# EAGLE design mouse_v4 (EAGLE 9.2.2)
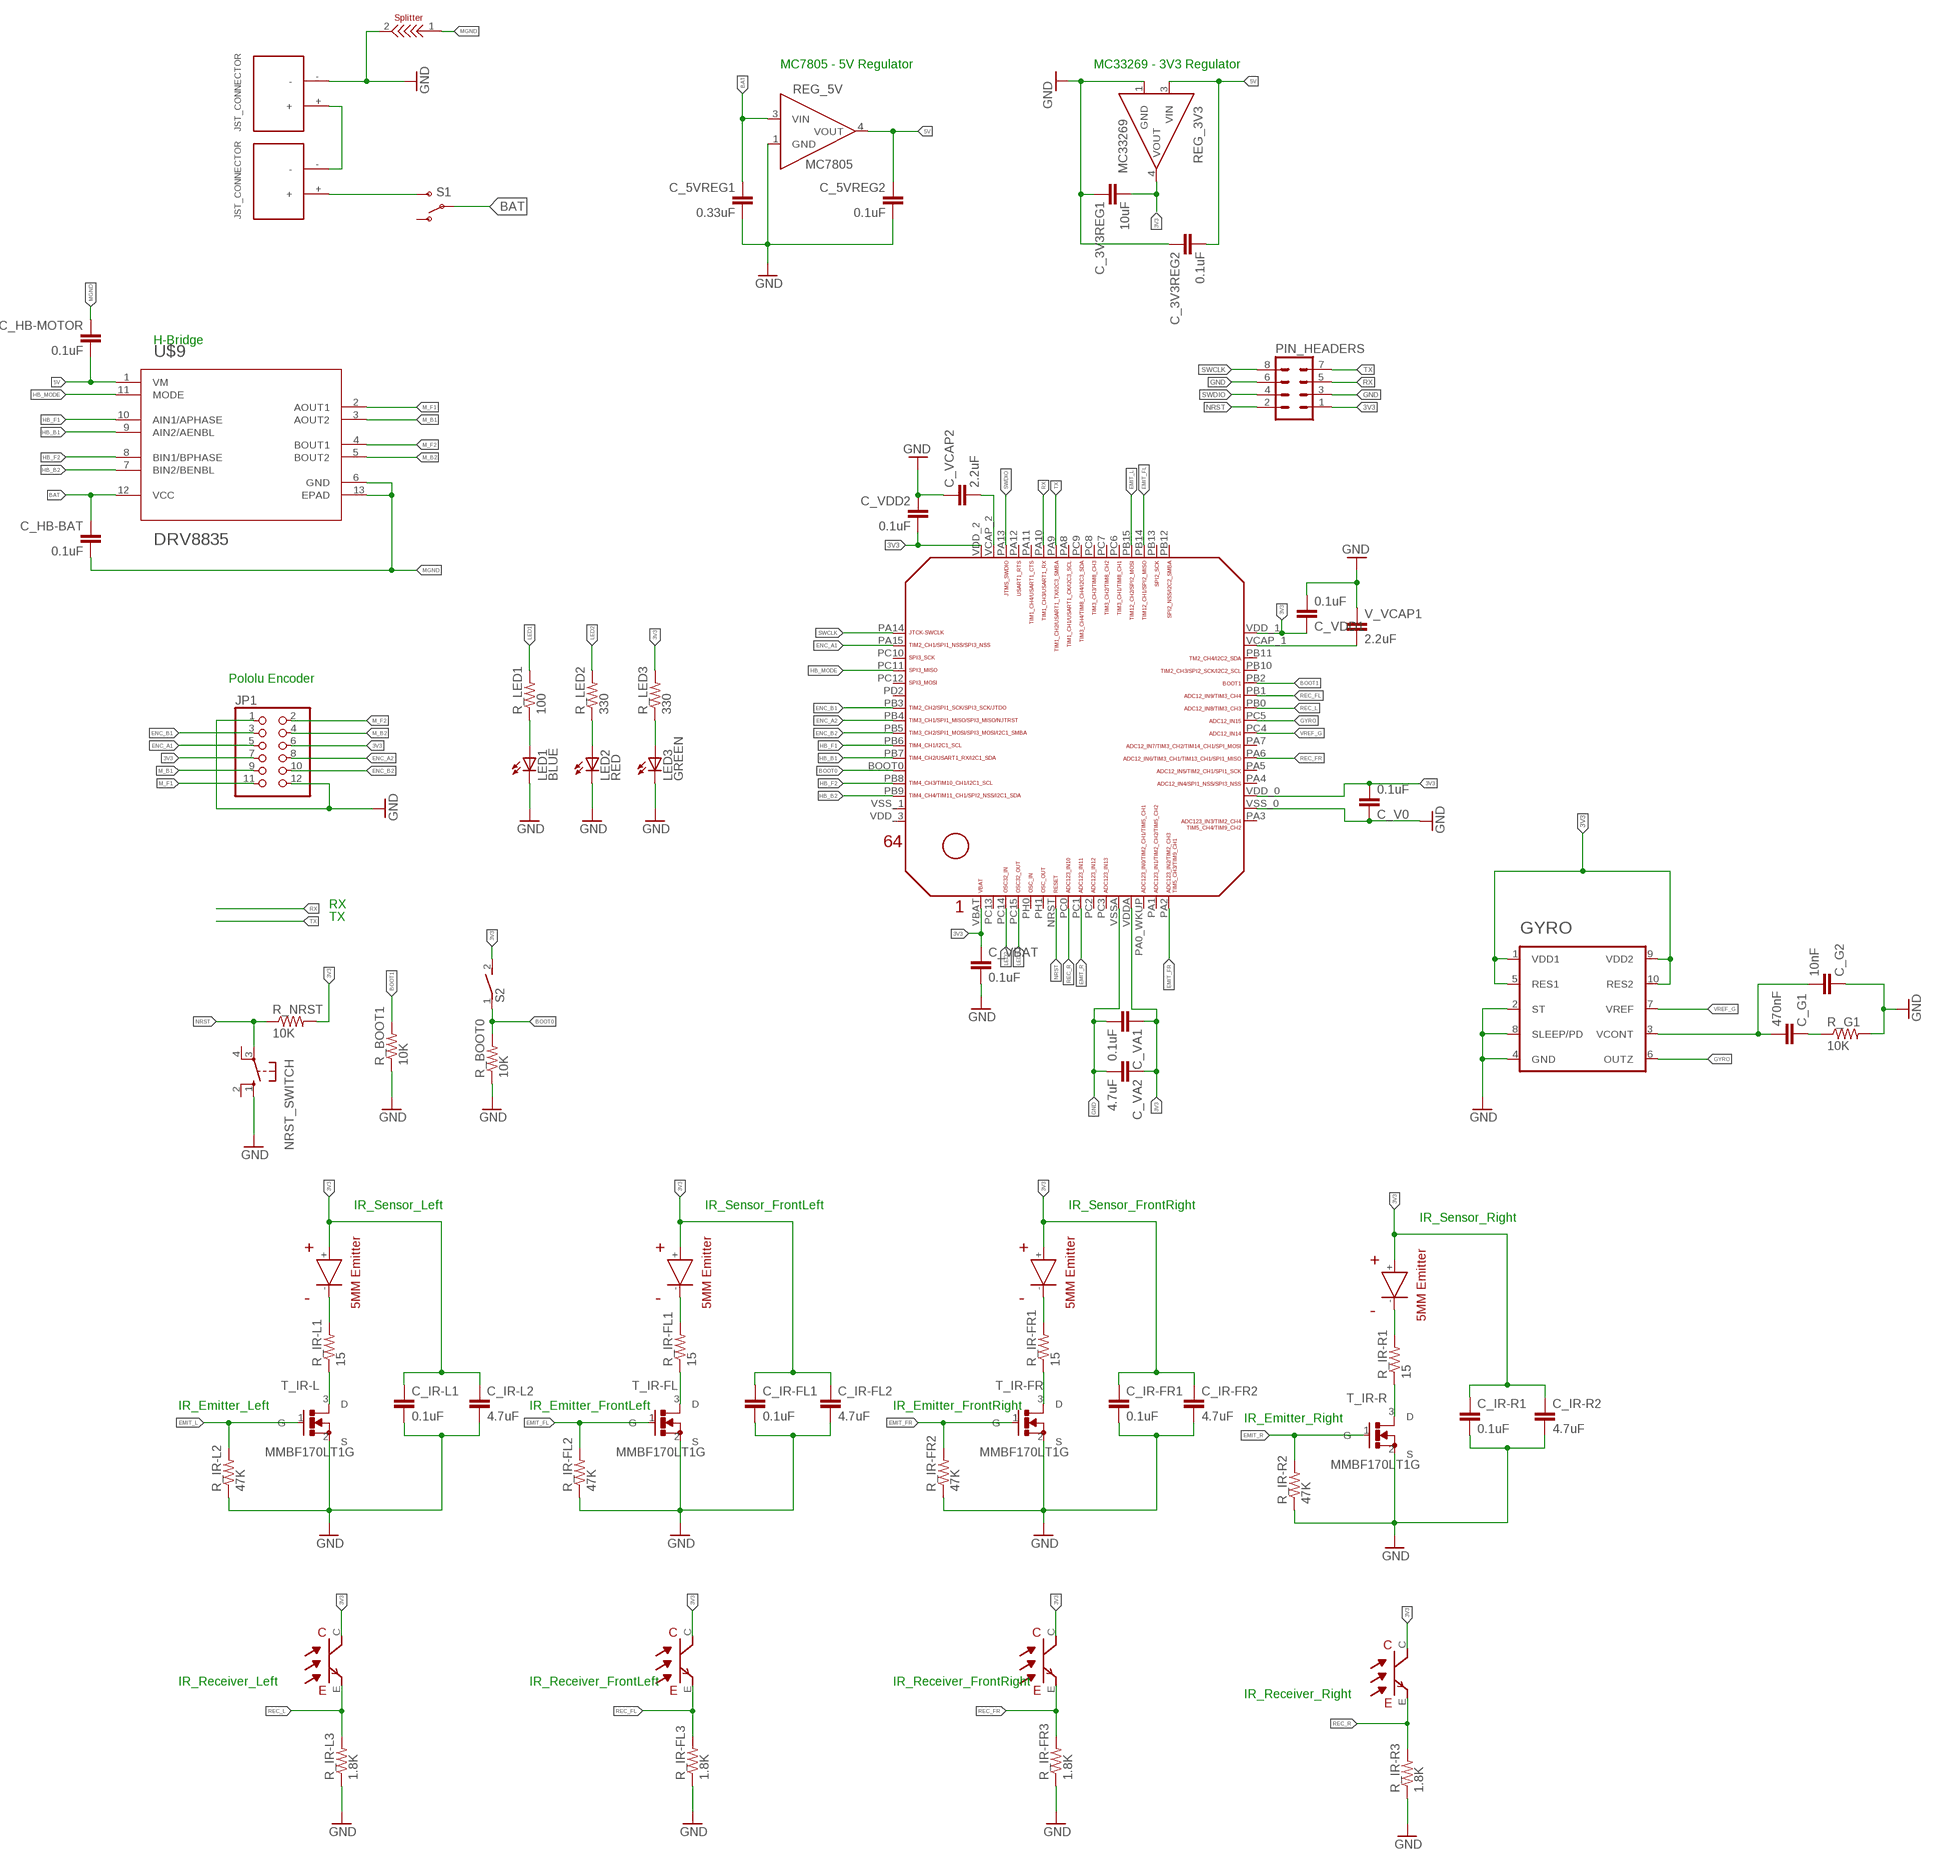
[diagram p0: schematic, sheet 1]

## Parts
C_3V3REG1  10uF  CAP0603-CAP  [0603-CAP]
C_3V3REG2  0.1uF  CAP0603-CAP  [0603-CAP]
C_5VREG1  0.33uF  CAP0603-CAP  [0603-CAP]
C_5VREG2  0.1uF  CAP0603-CAP  [0603-CAP]
C_G1  470nF  CAP0603-CAP  [0603-CAP]
C_G2  10nF  CAP0603-CAP  [0603-CAP]
C_HB-BAT  0.1uF  CAP0603-CAP  [0603-CAP]
C_HB-MOTOR  0.1uF  CAP0603-CAP  [0603-CAP]
C_IR-FL1  0.1uF  CAP0603-CAP  [0603-CAP]
C_IR-FL2  4.7uF  CAP0603-CAP  [0603-CAP]
C_IR-FR1  0.1uF  CAP0603-CAP  [0603-CAP]
C_IR-FR2  4.7uF  CAP0603-CAP  [0603-CAP]
C_IR-L1  0.1uF  CAP0603-CAP  [0603-CAP]
C_IR-L2  4.7uF  CAP0603-CAP  [0603-CAP]
C_IR-R1  0.1uF  CAP0603-CAP  [0603-CAP]
C_IR-R2  4.7uF  CAP0603-CAP  [0603-CAP]
C_V0  0.1uF  CAP0603-CAP  [0603-CAP]
C_VA1  0.1uF  CAP0603-CAP  [0603-CAP]
C_VA2  4.7uF  CAP0603-CAP  [0603-CAP]
C_VBAT  0.1uF  CAP0603-CAP  [0603-CAP]
C_VCAP2  2.2uF  CAP0603-CAP  [0603-CAP]
C_VDD1  0.1uF  CAP0603-CAP  [0603-CAP]
C_VDD2  0.1uF  CAP0603-CAP  [0603-CAP]
GYRO  LY3200ALH  [10-TLGA]
IR_FL  EMITTER  [EMITTER]
IR_FR  EMITTER  [EMITTER]
IR_L  EMITTER  [EMITTER]
IR_R  EMITTER  [EMITTER]
JP1  PINHD-2X6  [2X06]
LED1  BLUE  LEDCHIPLED_0603  [CHIPLED_0603]
LED2  RED  LEDCHIPLED_0603  [CHIPLED_0603]
LED3  GREEN  LEDCHIPLED_0603  [CHIPLED_0603]
NRST_SWITCH  10-XX  [B3F-10XX]
PIN_HEADERS  MA04-2  [MA04-2]
R_BOOT0  10K  1.8KOHM1/10W1%(0603)  [0603-RES]
R_BOOT1  10K  1.8KOHM1/10W1%(0603)  [0603-RES]
R_G1  10K  1.8KOHM1/10W1%(0603)  [0603-RES]
R_IR-FL1  15  1.8KOHM1/10W1%(0603)  [0603-RES]
R_IR-FL2  47K  1.8KOHM1/10W1%(0603)  [0603-RES]
R_IR-FL3  1.8K  1.8KOHM1/10W1%(0603)  [0603-RES]
R_IR-FR1  15  1.8KOHM1/10W1%(0603)  [0603-RES]
R_IR-FR2  47K  1.8KOHM1/10W1%(0603)  [0603-RES]
R_IR-FR3  1.8K  1.8KOHM1/10W1%(0603)  [0603-RES]
R_IR-L1  15  1.8KOHM1/10W1%(0603)  [0603-RES]
R_IR-L2  47K  1.8KOHM1/10W1%(0603)  [0603-RES]
R_IR-L3  1.8K  1.8KOHM1/10W1%(0603)  [0603-RES]
R_IR-R1  15  1.8KOHM1/10W1%(0603)  [0603-RES]
R_IR-R2  47K  1.8KOHM1/10W1%(0603)  [0603-RES]
R_IR-R3  1.8K  1.8KOHM1/10W1%(0603)  [0603-RES]
R_LED1  100  1.8KOHM1/10W1%(0603)  [0603-RES]
R_LED2  330  1.8KOHM1/10W1%(0603)  [0603-RES]
R_LED3  330  1.8KOHM1/10W1%(0603)  [0603-RES]
R_NRST  10K  1.8KOHM1/10W1%(0603)  [0603-RES]
REG_3V3  MC33269  [TO-252-3]
REG_5V  MC7805  [TO-252-3]
S1  SWITCH-SPSTKIT  [SWITCH-SPDT_KIT]
S2  DS01E  [DS-01]
T_IR-FL  MMBF170LT1G  [SOT-23]
T_IR-FR  MMBF170LT1G  [SOT-23]
T_IR-L  MMBF170LT1G  [SOT-23]
T_IR-R  MMBF170LT1G  [SOT-23]
U$1  STM32F405/415_LQFP64  [STM32F405/415_LQFP64]
U$2  JST_CONNECTOR_FEMALE  [JST_CONNECTOR_FEMALE]
U$3  JST_CONNECTOR_FEMALE  [JST_CONNECTOR_FEMALE]
U$4  RECEIVER  [RECEIVER]
U$5  RECEIVER  [RECEIVER]
U$6  RECEIVER  [RECEIVER]
U$7  RECEIVER  [RECEIVER]
U$8  SPLITTER  [SPLITTER]
U$9  DRV8835  [12-WFDFN]
V_VCAP1  2.2uF  CAP0603-CAP  [0603-CAP]

## Nets
3V3: C_3V3REG1.2 C_IR-FL1.1 C_IR-FL2.1 C_IR-FR1.1 C_IR-FR2.1 C_IR-L1.1 C_IR-L2.1 C_IR-R1.1 C_IR-R2.1 C_V0.2 C_VA1.1 C_VA2.1 C_VBAT.1 C_VDD1.1 C_VDD2.2 GYRO.1(VDD1) GYRO.5(RES1) GYRO.9(VDD2) GYRO.10(RES2) IR_FL.+ IR_FR.+ IR_L.+ IR_R.+ JP1.6 JP1.7 PIN_HEADERS.1 R_LED3.2 R_NRST.2 REG_3V3.4(VOUT) S2.2 U$1.VBAT U$1.VDD_0 U$1.VDD_1 U$1.VDD_2 U$1.VDDA U$4.C U$5.C U$6.C U$7.C
5V: C_3V3REG2.2 C_5VREG2.1 C_HB-MOTOR.2 REG_3V3.3(VIN) REG_5V.4(VOUT) U$9.1(VM)
BAT: C_5VREG1.1 C_HB-BAT.1 REG_5V.3(VIN) S1.2(P) U$9.12(VCC)
BOOT0: R_BOOT0.2 S2.1 U$1.BOOT0
BOOT1: R_BOOT1.2 U$1.PB2
EMIT_FL: R_IR-FL2.2 T_IR-FL.1(G) U$1.PB14
EMIT_FR: R_IR-FR2.2 T_IR-FR.1(G) U$1.PA2
EMIT_L: R_IR-L2.2 T_IR-L.1(G) U$1.PB15
EMIT_R: R_IR-R2.2 T_IR-R.1(G) U$1.PC1
ENC_A1: JP1.5 U$1.PA15
ENC_A2: JP1.8 U$1.PB4
ENC_B1: JP1.3 U$1.PB3
ENC_B2: JP1.10 U$1.PB5
GND: C_3V3REG1.1 C_3V3REG2.1 C_5VREG1.2 C_5VREG2.2 C_G2.1 C_IR-FL1.2 C_IR-FL2.2 C_IR-FR1.2 C_IR-FR2.2 C_IR-L1.2 C_IR-L2.2 C_IR-R1.2 C_IR-R2.2 C_V0.1 C_VA1.2 C_VA2.2 C_VBAT.2 C_VCAP2.1 C_VDD1.2 C_VDD2.1 GYRO.2(ST) GYRO.4(GND) GYRO.8(SLEEP/PD) JP1.1 JP1.12 LED1.C LED2.C LED3.C NRST_SWITCH.1(S) PIN_HEADERS.3 PIN_HEADERS.6 R_BOOT0.1 R_BOOT1.1 R_G1.2 R_IR-FL2.1 R_IR-FL3.1 R_IR-FR2.1 R_IR-FR3.1 R_IR-L2.1 R_IR-L3.1 R_IR-R2.1 R_IR-R3.1 REG_3V3.1(GND) REG_5V.1(GND) T_IR-FL.2(S) T_IR-FR.2(S) T_IR-L.2(S) T_IR-R.2(S) U$1.VSS_0 U$1.VSSA U$2.- U$8.2 V_VCAP1.1
GYRO: GYRO.6(OUTZ) U$1.PC5
HB_B1: U$1.PB7 U$9.9(AIN2/AENBL)
HB_B2: U$1.PB9 U$9.7(BIN2/BENBL)
HB_F1: U$1.PB6 U$9.10(AIN1/APHASE)
HB_F2: U$1.PB8 U$9.8(BIN1/BPHASE)
HB_MODE: U$1.PC11 U$9.11(MODE)
LED1: R_LED1.2 U$1.PC15
LED2: R_LED2.2 U$1.PC14
M_B1: JP1.9 U$9.3(AOUT2)
M_B2: JP1.4 U$9.5(BOUT2)
M_F1: JP1.11 U$9.2(AOUT1)
M_F2: JP1.2 U$9.4(BOUT1)
MGND: C_HB-BAT.2 C_HB-MOTOR.1 U$8.1 U$9.6(GND) U$9.13(EPAD)
N$2: C_VCAP2.2 U$1.VCAP_2
N$3: U$2.+ U$3.-
N$4: U$1.VCAP_1 V_VCAP1.2
N$5: C_G1.1 R_G1.1
N$6: S1.3(S) U$3.+
N$7: IR_FR.- R_IR-FR1.2
N$8: LED1.A R_LED1.1
N$9: C_G1.2 C_G2.2 GYRO.3(VCONT)
N$10: LED2.A R_LED2.1
N$11: LED3.A R_LED3.1
N$12: R_IR-FR1.1 T_IR-FR.3(D)
N$15: IR_R.- R_IR-R1.2
N$17: IR_FL.- R_IR-FL1.2
N$22: R_IR-FL1.1 T_IR-FL.3(D)
N$23: R_IR-R1.1 T_IR-R.3(D)
N$24: IR_L.- R_IR-L1.2
N$25: R_IR-L1.1 T_IR-L.3(D)
NRST: NRST_SWITCH.3(P) PIN_HEADERS.2 R_NRST.1 U$1.NRST
REC_FL: R_IR-FL3.2 U$1.PB1 U$5.E
REC_FR: R_IR-FR3.2 U$1.PA6 U$6.E
REC_L: R_IR-L3.2 U$1.PB0 U$4.E
REC_R: R_IR-R3.2 U$1.PC0 U$7.E
RX: PIN_HEADERS.5 U$1.PA10
SWCLK: PIN_HEADERS.8 U$1.PA14
SWDIO: PIN_HEADERS.4 U$1.PA13
TX: PIN_HEADERS.7 U$1.PA9
VREF_G: GYRO.7(VREF) U$1.PC4
Unconnected: NRST_SWITCH.2(S1) NRST_SWITCH.4(P1) S1.1(O) U$1.PA0_WKUP(PA0_AKUP) U$1.PA1 U$1.PA3 U$1.PA4 U$1.PA5 U$1.PA7 U$1.PA8 U$1.PA11 U$1.PA12 U$1.PB10 U$1.PB11 U$1.PB12 U$1.PB13 U$1.PC2 U$1.PC3 U$1.PC6 U$1.PC7 U$1.PC8 U$1.PC9 U$1.PC10 U$1.PC12 U$1.PC13 U$1.PD2 U$1.PH0 U$1.PH1 U$1.VDD_3 U$1.VSS_1

## Notes on the sheet
- MC7805 - 5V Regulator | MC33269 - 3V3 Regulator
- H-Bridge
- Pololu Encoder
- RX
- TX
- IR_Sensor_Left | IR_Sensor_FrontLeft | IR_Sensor_FrontRight
- IR_Sensor_Right
- IR_Emitter_Left | IR_Emitter_FrontLeft | IR_Emitter_FrontRight
- IR_Emitter_Right
- IR_Receiver_Left | IR_Receiver_FrontLeft | IR_Receiver_FrontRight
- IR_Receiver_Right

## Library data of the parts
C_3V3REG1 C_3V3REG2 C_5VREG1 C_5VREG2 C_G1 C_G2 C_HB-BAT C_HB-MOTOR C_IR-FL1 C_IR-FL2 C_IR-FR1 C_IR-FR2 C_IR-L1 C_IR-L2 C_IR-R1 C_IR-R2 C_V0 C_VA1 C_VA2 C_VBAT C_VCAP2 C_VDD1 C_VDD2 V_VCAP1 = SparkFun:CAP: Capacitor Standard 0603 ceramic capacitor, and 0.1" leaded capacitor.
GYRO = LY3200ALH:LY3200ALH
IR_FL IR_FR IR_L IR_R = sfh4550 _ teft4300:EMITTER
JP1 = pinhead:PINHD-2X6: PIN HEADER
LED1-LED3 = led:LED: LED OSRAM: - CHIPLED LG R971, LG N971, LY N971, LG Q971, LY Q971, LO R971, LY R971 LH N974, LH R974 LS Q976, LO Q976, LY Q976 LO Q996 - Hyper CHIPLED LW Q18S LB Q993, LB Q99A, LB R99A - SideLED LS A670, LO A670, LY A670, LG A670, LP A670 LB A673, LV A673, LT A673, LW A673 LH A674 LY A675 LS A676, LA A676, LO A676, LY A676, LW A676 LS A679, LY A679, LG A679 - Hyper Micro SIDELED® LS Y876, LA Y876, LO Y876, LY Y876 LT Y87S - SmartLED LW L88C, LW L88S LB L89C, LB L89S, LG L890 LS L89K, LO L89K, LY L89K LS L896, LA L896, LO L896, LY L896 - TOPLED LS T670, LO T670, LY T670, LG T670, LP T670 LSG T670, LSP T670, LSY T670, LOP T670, LYG T670 LG T671, LOG T671, LSG T671 LB T673, LV T673, LT T673, LW T673 LH T674 LS T676, LA T676, LO T676, LY T676, LB T676, LH T676, LSB T676, LW T676 LB T67C, LV T67C, LT T67C, LS T67K, LO T67K, LY T67K, LW E67C LS E67B, LA E67B, LO E67B, LY E67B, LB E67C, LV E67C, LT E67C LW T67C LS T679, LY T679, LG T679 LS T770, LO T770, LY T770, LG T770, LP T770 LB T773, LV T773, LT T773, LW T773 LH T774 LS E675, LA E675, LY E675, LS T675 LS T776, LA T776, LO T776, LY T776, LB T776 LHGB T686 LT T68C, LB T68C - Hyper Mini TOPLED® LB M676 - Mini TOPLED Santana® LG M470 LS M47K, LO M47K, LY M47K Source: http://www.osram.convergy.de LUXEON: - LUMILED® LXK2-PW12-R00, LXK2-PW12-S00, LXK2-PW14-U00, LXK2-PW14-V00 LXK2-PM12-R00, LXK2-PM12-S00, LXK2-PM14-U00 LXK2-PE12-Q00, LXK2-PE12-R00, LXK2-PE12-S00, LXK2-PE14-T00, LXK2-PE14-U00 LXK2-PB12-K00, LXK2-PB12-L00, LXK2-PB12-M00, LXK2-PB14-N00, LXK2-PB14-P00, LXK2-PB14-Q00 LXK2-PR12-L00, LXK2-PR12-M00, LXK2-PR14-Q00, LXK2-PR14-R00 LXK2-PD12-Q00, LXK2-PD12-R00, LXK2-PD12-S00 LXK2-PH12-R00, LXK2-PH12-S00 LXK2-PL12-P00, LXK2-PL12-Q00, LXK2-PL12-R00 Source: www.luxeon.com KINGBRIGHT: KA-3528ASYC Source: www.kingbright.com
NRST_SWITCH = switch-omron:10-XX: OMRON SWITCH; MPN: B3F-1000; OC_FARNELL: 176432; OC_NEWARK: 36M3542
PIN_HEADERS = con-lstb:MA04-2: PIN HEADER; OC_FARNELL: unknown; OC_NEWARK: unknown
R_BOOT0 R_BOOT1 R_G1 R_IR-FL1-R_IR-FL3 R_IR-FR1-R_IR-FR3 R_IR-L1-R_IR-L3 R_IR-R1-R_IR-R3 R_LED1-R_LED3 R_NRST = SparkFun-Resistors:1.8KOHM1/10W1%(0603): RES-09119; PROD_ID: RES-09119; VALUE: 1.8k
REG_3V3 = MC33269:MC33269
REG_5V = MC33269:MC7805
S1 = SparkFun:SWITCH-SPST: SPST Switch Simple slide switch. Spark Fun Electronics SKU : COM-00102
S2 = switch-dil:DS01E: DIL/CODE SWITCH; OC_FARNELL: unknown; OC_NEWARK: unknown
T_IR-FL T_IR-FR T_IR-L T_IR-R = MMBF170LT1:MMBF170LT1G; MANUFACTURER_PART_NUMBER: MMBF170LT1G; VENDOR: ON Semiconductor
U$1 = STM32F10x F4xx:STM32F405/415_LQFP64
U$2 U$3 = JST_CONNECTOR_FEMALE. through hole:JST_CONNECTOR_FEMALE
U$4-U$7 = sfh4550 _ teft4300:RECEIVER
U$8 = splitter:SPLITTER
U$9 = DRV8835:DRV8835

## Board
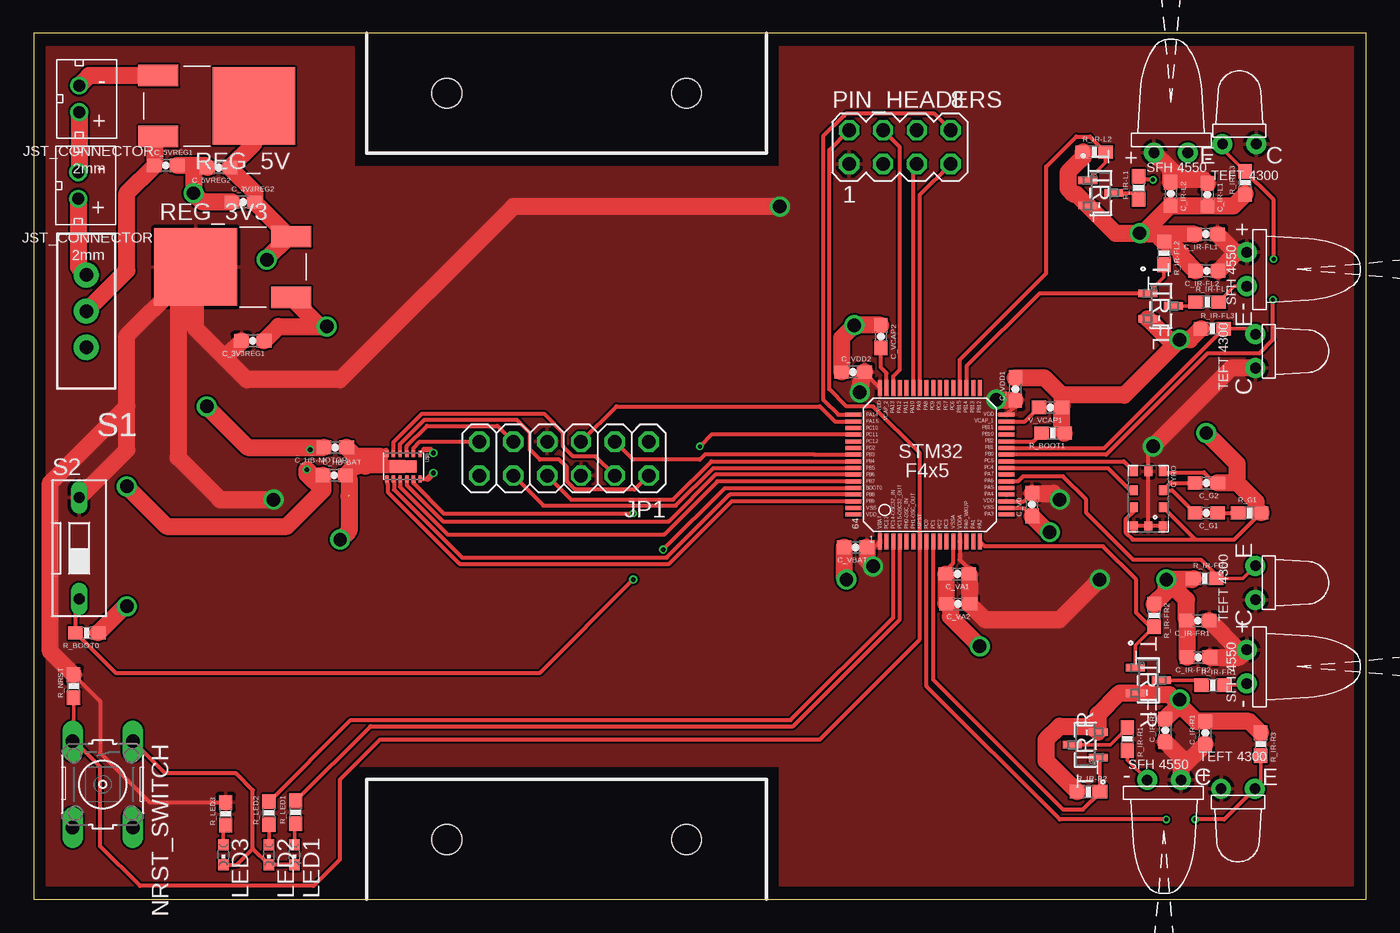
[diagram p1: board, top side]
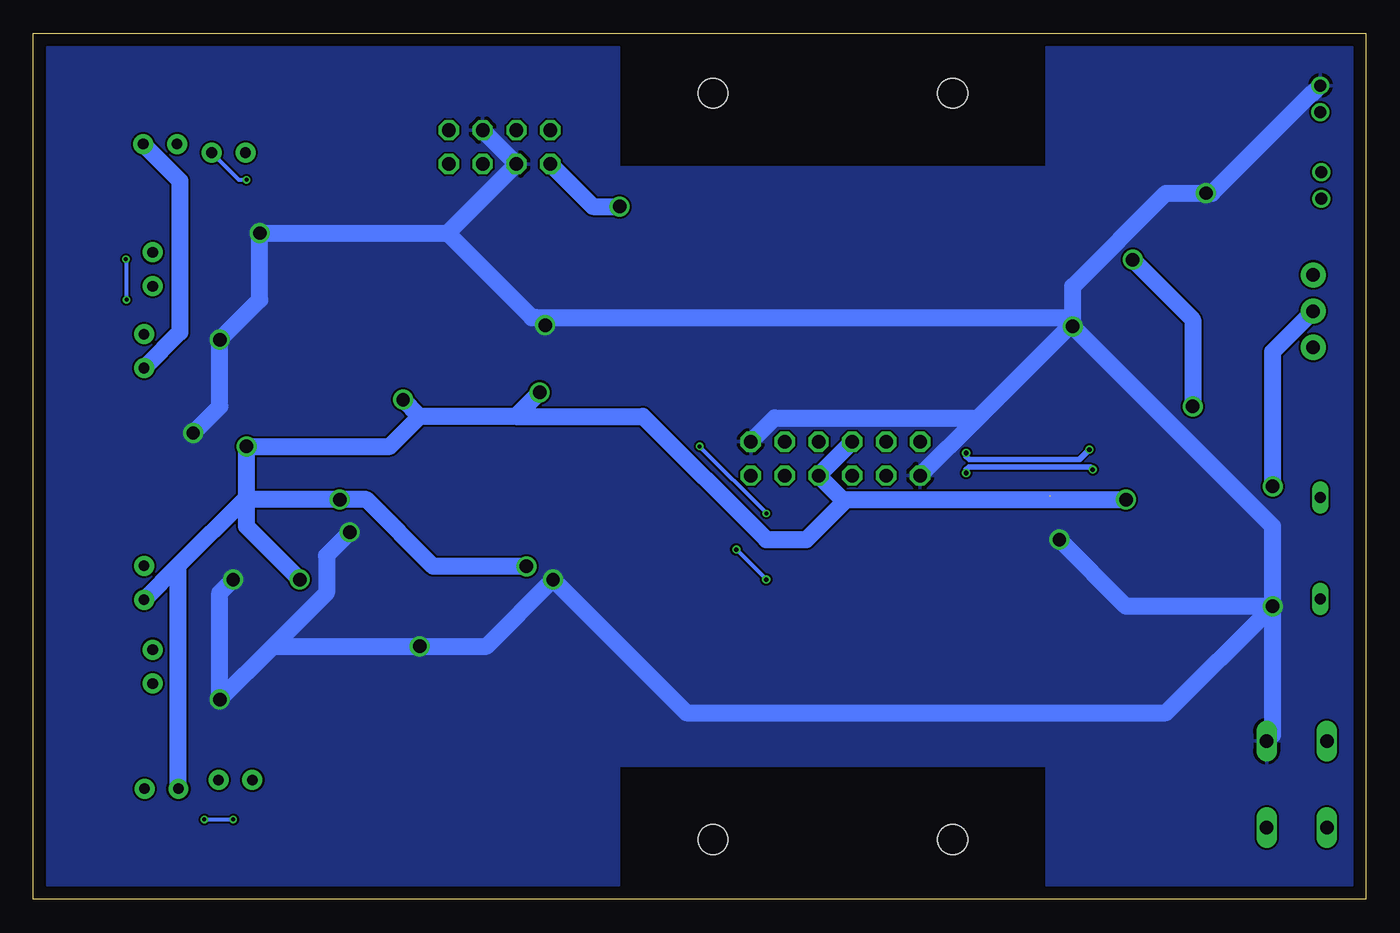
[diagram p2: board, bottom side, seen from below]

Size 100 x 65 mm. Coordinates in mm from the lower left corner, seen from the top.
Outline: 0,0 100,0 100,65 0,65 0,0
Copper layers (1*16): Top 0.035559375mm / dielectric 1.6mm / Bottom 0.035559375mm
Design rules "oshpark-2layer": minimum track width 6mil, minimum drill 10mil, track to track 6mil, track to pad 6mil, pad to pad 6mil, via to via 6mil, smd to smd 6mil, copper to edge 15mil, drill to drill 6mil, minimum pad ring 5mil, minimum via ring 5mil, stop-mask expansion 2.5mil, vias tented up to drill 0mil, thermal gap 10mil
Holes 2.25 mm at 31,4.5 49,4.5 49,60.5 31,60.5
tKeepout: area 25,56 to 55,65; area 25,0 to 55,9
bKeepout: area 25,0 to 55,9; area 25,56 to 55,65
tRestrict: area 25,0 to 55,9; area 25,56 to 55,65
bRestrict: area 25,0 to 55,9; area 25,56 to 55,65

### Footprints (pad centres in the part's own frame; a part is rotated, then mirrored left to right if it is on the bottom)
0603-CAP = smd 1.1 x 1: 1 -0.85,0; 2 0.85,0
10-TLGA = smd 0.7 x 0.6: 1 2.05,1.1; 2 0.635,1.1; 3 -0.635,1.1; 4 -2.05,1.1; 5 -2.05,0; 6 -2.05,-1.1; 7 -0.635,-1.1; 8 0.635,-1.1; 9 2.05,-1.1; 10 2.05,0
EMITTER = drill 0.8 pad 1.5: + -1.27,-0.5; - 1.27,-0.5
2X06 = drill 1.016 octagon: 1 -6.35,-1.27; 2 -6.35,1.27; 3 -3.81,-1.27; 4 -3.81,1.27; 5 -1.27,-1.27; 6 -1.27,1.27; 7 1.27,-1.27; 8 1.27,1.27; 9 3.81,-1.27; 10 3.81,1.27; 11 6.35,-1.27; 12 6.35,1.27
CHIPLED_0603 = smd 0.8 x 0.8: A 0,-0.75; C 0,0.75
B3F-10XX = drill 1.016 long: 1 -3.251,2.261; 2 3.251,2.261; 3 -3.251,-2.261; 4 3.251,-2.261
MA04-2 = drill 1.016 octagon: 1 -3.81,-1.27; 2 -3.81,1.27; 3 -1.27,-1.27; 4 -1.27,1.27; 5 1.27,-1.27; 6 1.27,1.27; 7 3.81,-1.27; 8 3.81,1.27
0603-RES = smd 1.1 x 1: 1 -0.85,0; 2 0.85,0
TO-252-3 = smd 3 x 1.6: 1 4.39,-2.285; 3 4.39,2.285 | smd 6.2 x 5.8: 4 -2.79,0
SWITCH-SPDT_KIT = drill 1.016 pad 1.88: 1 0,2.718; 2 0,0; 3 0,-2.718
DS-01 = drill 0.813 long: 1 0,-3.81; 2 0,3.81
SOT-23 = smd 0.559 x 1.422: 1 -0.953,-0.965; 2 0.953,-0.965; 3 0,0.965
STM32F405/415_LQFP64 = smd 1.2 x 0.3: BOOT0 -5.75,-1.75; PA3 5.75,-3.75; PA4 5.75,-2.25; PA5 5.75,-1.75; PA6 5.75,-1.25; PA7 5.75,-0.75; PA14 -5.75,3.75; PA15 -5.75,3.25; PB0 5.75,0.75; PB1 5.75,1.25; PB2 5.75,1.75; PB3 -5.75,0.75; PB4 -5.75,0.25; PB5 -5.75,-0.25; PB6 -5.75,-0.75; PB7 -5.75,-1.25; PB8 -5.75,-2.25; PB9 -5.75,-2.75; PB10 5.75,2.25; PB11 5.75,2.75; PC4 5.75,-0.25; PC5 5.75,0.25; PC10 -5.75,2.75; PC11 -5.75,2.25; PC12 -5.75,1.75; PD2 -5.75,1.25; VCAP_1 5.75,3.25; VDD_0 5.75,-2.75; VDD_1 5.75,3.75; VDD_3 -5.75,-3.75; VSS_0 5.75,-3.25; VSS_1 -5.75,-3.25 | smd 0.3 x 1.2: NRST -0.75,-5.75; PA0_WKUP 2.75,-5.75; PA1 3.25,-5.75; PA2 3.75,-5.75; PA8 -0.25,5.75; PA9 -0.75,5.75; PA10 -1.25,5.75; PA11 -1.75,5.75; PA12 -2.25,5.75; PA13 -2.75,5.75; PB12 3.75,5.75; PB13 3.25,5.75; PB14 2.75,5.75; PB15 2.25,5.75; PC0 -0.25,-5.75; PC1 0.25,-5.75; PC2 0.75,-5.75; PC3 1.25,-5.75; PC6 1.75,5.75; PC7 1.25,5.75; PC8 0.75,5.75; PC9 0.25,5.75; PC13 -3.25,-5.75; PC14 -2.75,-5.75; PC15 -2.25,-5.75; PH0 -1.75,-5.75; PH1 -1.25,-5.75; VBAT -3.75,-5.75; VCAP_2 -3.25,5.75; VDD_2 -3.75,5.75; VDDA 2.25,-5.75; VSSA 1.75,-5.75
JST_CONNECTOR_FEMALE = drill 0.889: + 0,1; - 0,-1
RECEIVER = drill 0.8 pad 1.5: C 1.27,-0.5; E -1.27,-0.5
SPLITTER = smd 0.102 x 0.102: 1 0,0; 2 0,0
12-WFDFN = smd 0.5 x 0.25: 1 -0.95,1.25; 2 -0.95,0.75; 3 -0.95,0.25; 4 -0.95,-0.25; 5 -0.95,-0.75; 6 -0.95,-1.25; 7 0.95,-1.25; 8 0.95,-0.75; 9 0.95,-0.25; 10 0.95,0.25; 11 0.95,0.75; 12 0.95,1.25 | smd 0.9 x 2: 13 0,0

### Placement (x,y rotation side)
C_3V3REG1  16.45,41.92 180 top
C_3V3REG2  15.74,52.33 0 top
C_5VREG1  9.93,55.08 0 top
C_5VREG2  13.88,54.92 180 top
C_G1  88,29 180 top
C_G2  88,31.25 180 top
C_HB-BAT  22.56,31.83 0 top
C_HB-MOTOR  22.64,33.92 180 top
C_IR-FL1  87.98,49.92 180 top
C_IR-FL2  88.04,47.17 180 top
C_IR-FR1  87.36,20.92 180 top
C_IR-FR2  87.42,18.17 180 top
C_IR-L1  88.08,52.89 270 top
C_IR-L2  85.33,52.95 270 top
C_IR-R1  87.92,12.49 90 top
C_IR-R2  84.92,12.68 90 top
C_V0  74.92,29.62 90 top
C_VA1  69.31,24.42 180 top
C_VA2  69.37,22.17 180 top
C_VBAT  61.68,26.42 180 top
C_VCAP2  63.58,42.24 270 top
C_VDD1  73.67,38.31 90 top
C_VDD2  61.5,39.58 0 top
GYRO  83.65,30.07 270 top
IR_FL  91.54,47.29 270 top
IR_FR  91.54,17.47 270 top
IR_L  85.35,56.54 0 top
IR_R  84.83,8.46 180 top
JP1  39.81,33.08 180 top
LED1  19.58,3.35 180 top
LED2  17.66,3.35 180 top
LED3  14.24,3.35 180 top
NRST_SWITCH  5.19,8.63 270 top
PIN_HEADERS  65.01,56.46 0 top
R_BOOT0  4,20 180 top
R_BOOT1  76.5,35 180 top
R_G1  91.25,29 0 top
R_IR-FL1  88.07,44.83 0 top
R_IR-FL2  84.83,48.49 270 top
R_IR-FL3  88.45,42.83 0 top
R_IR-FR1  88.5,16.08 0 top
R_IR-FR2  84.08,21.31 270 top
R_IR-FR3  87.88,24.08 0 top
R_IR-L1  82.92,53.4 90 top
R_IR-L2  79.59,56.08 0 top
R_IR-L3  90.92,53.78 90 top
R_IR-R1  82.08,12.03 270 top
R_IR-R2  79.16,8.08 0 top
R_IR-R3  92.08,11.65 270 top
R_LED1  19.67,6.54 90 top
R_LED2  17.67,6.48 90 top
R_LED3  14.42,6.42 90 top
R_NRST  3,16 90 top
REG_3V3  14.95,47.46 0 top
REG_5V  13.75,59.54 180 top
S1  3.96,44.15 180 top
S2  3.42,26.35 0 top
T_IR-FL  84.58,44.53 270 top
T_IR-FR  83.65,16.44 270 top
T_IR-L  80.08,53.02 270 top
T_IR-R  78.92,11.6 90 top
U$1  67.26,32.62 0 top
U$2  3.42,60.08 180 top
U$3  3.35,53.58 180 top
U$4  90.48,57.19 0 top
U$5  92.19,41.14 270 top
U$6  92.19,23.76 270 top
U$7  90.38,7.81 180 top
U$8  23.66,30.31 0 top
U$9  27.75,32.5 270 top
V_VCAP1  76.3,36.92 180 top

### Tracks (layer width: path | path; a pad name or v marks a point on that pad's centre or on a via)
3V3  (via drill 1)
  Top 0.305: U$1.VDD_1 73.67,37.03 C_VDD1.1 | U$1.VDD_0 74.32,29.87 C_V0.2 | C_VBAT.1 63.06,26.42 U$1.VBAT | C_VDD2.2 62.8,39.08 U$1.VDD_2 | U$1.VDDA 69.51,25.49 70.16,24.84 C_VA1.1 | R_NRST.2 5,14.85 5,11 8.73,7.27 R_LED3.2 | GYRO.1 GYRO.10 | GYRO.10 GYRO.9 | GYRO.10 GYRO.5 83.65,33.65 v84,34
  Top 1.27: S2.2 7,33.74 7,37 | 10.85,46.15 7,42.3 7,37 | 10.85,46.15 REG_3V3.4 12.16,42.84 14.5,40.5 | C_VA1.1 70.22,24.36 C_VA2.1 71.39,21 77,21 v80,24 | 10.85,46.15 10.85,33.15 14,30 v18,30 | R_NRST.2 1.25,18.6 1.25,31.25 7,37 | C_VDD2.2 62.07,38.8 62.07,38.49 62,38.42 v62,38.05 | v72.25,37.5 72.29,37.46 C_VDD1.1 | U$5.C 89.87,39.87 v84,34 | C_V0.2 76.53,30.47 v77,30 | C_VBAT.1 62.53,25.47 v63,25 | v56,52 36,52 23,39 16,39 14.5,40.5 | C_3V3REG1.2 14.5,40.82 14.5,40.5 | C_IR-R2.1 86.1,10.65 IR_R.+ 86.1,9.82 C_IR-R1.1 | C_IR-FR1.1 90.39,18.74 IR_FR.+ 90.47,18.17 C_IR-FR2.1 | C_IR-FL2.1 90.28,48.56 | 90.28,48.56 IR_FL.+ | C_IR-FL1.1 90.19,48.56 90.28,48.56 | C_IR-L2.1 85.33,54.79 | 85.33,54.79 IR_L.+ | C_IR-L1.1 87.82,54 86.12,54 85.33,54.79
  Bottom 1.27: 39.27,30 JP1.6 JP1.7 | 39.27,30 v18,30 | v62,38.05 63.8,36.25 | 71,36.25 v72.25,37.5 | 63.8,36.25 71,36.25 | 71,36.25 73.25,34 v84,34 84,30.18 | 63.8,36.25 54.25,36.25 45,27 42,27 39.27,29.73 39.27,30 | U$6.C 89.11,25.07 | 89.11,25.07 84,30.18 | U$7.C 89.11,25.07 | U$4.C 89,53.94 89,42.56 U$5.C | 84,30.18 83.82,30 v77,30 75,30 70,25 v63,25 | v80,24 84,28 84,30.18 | PIN_HEADERS.1 58.01,52 v56,52
  pour Top: 1,64 24,64 24,55 56,55 56,64 99,64 99,1 56,1 56,10 24,10 24,1 1,1
5V  (via drill 0.35, 1)
  Top 0.305: U$9.1 29.3,33.75
  Top 0.406: v20.75,33.75 20.75,34 21,34.25 21.46,34.25 C_HB-MOTOR.2 | v30,33.5 29.75,33.75 29.3,33.75
  Top 1.27: REG_5V.4 16.54,56.73 C_5VREG2.1 16.59,53.06 C_3V3REG2.2 19.18,49.74 | 19.18,49.74 REG_3V3.3 | v17.5,48 17.43,48 19.18,49.74 | v13,37 16.08,33.92 C_HB-MOTOR.2
  Bottom 0.406: v30,33.5 30,33.25 29.75,33 21.5,33 v20.75,33.75
  Bottom 1.27: v17.5,48 13,43.5 v13,37
BAT  (via drill 0.35, 1)
  Top 0.305: U$9.12 29.55,31.55
  Top 0.406: 29.55,31.55 v30,32
  Top 1.27: REG_5V.3 9.08,56.98 C_5VREG1.1 7,53 7,47.19 S1.2 | v7,31 10,28 19,28 21.71,30.71 | 21.71,30.71 C_HB-BAT.1 20.92,31.83 v20.5,32.25 20.5,31.92 21.71,30.71
  Bottom 0.406: v30,32 30,32.25 29.81,32.44 20.69,32.44 v20.5,32.25
  Bottom 1.27: v7,31 7,41.11 S1.2
BOOT0  (via drill 0.35)
  Top 0.305: S2.1 3.15,22.27 R_BOOT0.2 6.15,17 38,17 v45,24 | U$1.BOOT0 51.87,30.87 v47.25,26.25
  Bottom 0.305: v45,24 v47.25,26.25
BOOT1
  Top 0.305: U$1.PB2 75.02,34.37 R_BOOT1.2
EMIT_FL
  Top 0.254: T_IR-FL.1 84.83,46.7 R_IR-FL2.2
  Top 0.305: T_IR-FL.1 75.48,45.48 70.01,40.01 U$1.PB14
EMIT_FR
  Top 0.254: R_IR-FR2.2 82.69,19.07 T_IR-FR.1
  Top 0.305: R_IR-FR2.2 83.79,20.46 82.75,21.5 82.75,24 80.25,26.5 71.38,26.5 U$1.PA2
EMIT_L
  Top 0.254: T_IR-L.1 80.44,55.3 R_IR-L2.2
  Top 0.305: U$1.PB15 69.51,40.51 76,47 76,55 78.25,57.25 79.27,57.25 R_IR-L2.2
EMIT_R
  Top 0.254: T_IR-R.1 80.01,10.52 R_IR-R2.2
  Top 0.305: R_IR-R2.2 80.01,8.01 78.75,6.75 77.25,6.75 67.52,16.48 U$1.PC1
ENC_A1
  Top 0.305: JP1.5 43.73,37 59,37 60.13,35.87 U$1.PA15
ENC_A2
  Top 0.305: JP1.8 40.35,30 48,30 50.87,32.87 U$1.PB4
ENC_B1
  Top 0.305: U$1.PB3 59,33.37 58.63,33.37 50.37,33.37 50,33 44.97,33 JP1.3
ENC_B2
  Top 0.305: JP1.10 38.27,29.54 48.19,29.54 51.02,32.37 U$1.PB5
GND  (via drill 1)
  Top 0.305: U$1.VSS_0 74.32,29.37 C_V0.1 | C_G2.1 88.63,31.25 87.83,32.05 84.81,32.05 GYRO.4 | GYRO.8 82.55,29.1 81.94,28.5 81.94,27.54 82.49,27 87.19,27 | R_G1.2 90.1,27 87.19,27 | GYRO.2 87.19,27 | LED1.C LED2.C 16.46,3.8 | 16.46,3.8 16.46,8.19 15.19,9.46 9.88,9.46 NRST_SWITCH.1 | LED3.C 15.25,2.6 16.46,3.8 | C_VA1.2 68.46,24.71 69.01,25.26 U$1.VSSA
  Top 1.27: C_IR-R2.2 86,14.61 | 86,14.61 v86,15 | 86,14.61 87.27,13.34 C_IR-R1.2 91.24,13.34 R_IR-R3.1 | 86,14.61 85.24,15.37 83.58,15.37 83.46,15.49 T_IR-FR.2 81.49,15.49 79.89,13.88 T_IR-R.2 79.44,13 77,13 76,12 76,10.39 R_IR-R2.1 | R_IR-FR2.1 85,23.08 v85,24 | R_IR-FR3.1 86.95,24 v85,24 | v85,24 86.51,22.49 C_IR-FR1.2 86.57,20.86 C_IR-FR2.2 | R_IR-L3.1 90.03,52.04 C_IR-L1.2 85.39,52.04 C_IR-L2.2 83.23,50 | 83.23,50 v83,50 81.18,50 T_IR-L.2 78.28,52.91 78.08,52.91 77.62,53.37 77.62,54.58 78.74,55.7 R_IR-L2.1 | 83.23,50 84.17,50 R_IR-FL2.1 85.29,49.34 86.12,48.52 86.12,48.24 C_IR-FL2.2 | C_IR-FL1.2 83.31,49.92 83.23,50 | T_IR-FL.2 85.19,42 v86,42 | R_IR-FL3.1 86.77,42 v86,42 | REG_5V.1 4.17,61.83 U$2.- | C_5VREG2.2 12.87,55.08 12,55.08 | 12,55.08 C_5VREG1.2 | 12,55.08 v12,53 12.67,52.33 C_3V3REG2.1 | REG_3V3.1 21.52,43 | 21.52,43 v22,43 | C_3V3REG1.1 18.38,43 21.52,43 | R_BOOT0.1 6.85,22 v7,22 | C_VCAP2.1 v61.59,43.09 60.65,42.15 C_VDD2.1 | C_VDD1.2 75.84,39.16 77.15,37.85 | 77.15,37.85 V_VCAP1.1 77.15,35.2 R_BOOT1.1 | v86,42 81.85,37.85 77.15,37.85 | R_G1.2 91.74,29.36 91.74,29.83 90.31,31.25 | 90.31,31.25 C_G2.1 | 90.31,31.25 90.31,32.69 v88,35 | v61,24 60.83,24.17 C_VBAT.2 | C_V0.1 76.14,27.55 v76.25,27.55 | C_VA1.2 68.46,22.23 C_VA2.2 68.8,21.89 68.8,21.2 v71,19 | U$8.2 23.66,27.66 v23,27
  Bottom 1.27: U$2.- 3.97,60.53 4.02,60.53 11.56,53 v12,53 15,53 22,46 v22,43 | JP1.12 29.14,36.13 | 29.14,36.13 22.27,43 v22,43 | v7,22 7,28 v22,43 | NRST_SWITCH.1 7,12.33 v7,22 | JP1.1 44.38,36.13 29.14,36.13 | PIN_HEADERS.6 PIN_HEADERS.3 68.93,50 | 68.93,50 v83,50 83,45 v86,42 86,37 v88,35 | v85,24 86,23 v86,15 82,19 | 68.93,50 62.59,43.66 62.16,43.66 | 62.16,43.66 22.66,43.66 v22,43 | 82,19 v71,19 66,19 v61,24 51,14 15,14 v7,22 | v76.25,27.55 78,25.8 78,23 82,19 | v61.59,43.09 62.16,43.66 | v7,22 18,22 v23,27
  pour Bottom: 1,64 24,64 24,55 56,55 56,64 99,64 99,1 56,1 56,10 24,10 24,1 1,1
GYRO
  Top 0.305: U$1.PC5 81.8,32.87 GYRO.6
HB_B1
  Top 0.305: U$1.PB7 51.31,31.37 47.34,27.4 31.05,27.4 27.5,30.95 U$9.9
HB_B2
  Top 0.305: U$1.PB9 52.38,29.87 47.69,25.19 31.97,25.19 26.57,30.59 26.57,31.17 26.54,31.2 26.54,31.51 U$9.7
HB_F1
  Top 0.305: U$1.PB6 51.16,31.87 47.67,28.38 30.72,28.38 28,31.1 U$9.10
HB_F2
  Top 0.305: U$1.PB8 52.23,30.37 47.5,25.64 32.16,25.64 27.04,30.76 27.04,31.51 U$9.8
HB_MODE  (via drill 0.3)
  Top 0.305: U$1.PC11 50.87,34.87 v50,34 | U$9.11 28.5,31.24 30.78,28.96 v45,28.96
  Bottom 0.305: v50,34 45,29 v45,28.96
LED1
  Top 0.305: R_LED1.2 25.28,13 57,13 65.01,21.01 U$1.PC15
LED2
  Top 0.305: R_LED2.2 23.8,13.46 56.81,13.46 64.51,21.16 U$1.PC14
M_B1
  Top 0.305: JP1.9 34.81,35.54 29.53,35.54 28,34.02 U$9.3
M_B2
  Top 0.305: JP1.4 42.18,33.25 40.5,33.25 39.75,34 39.75,35 38.29,36.46 29.15,36.46 27,34.31 U$9.5
M_F1
  Top 0.305: JP1.11 28.98,34.35 28.5,33.87 U$9.2
M_F2
  Top 0.305: JP1.2 45.09,30.74 43.18,30.74 43.17,30.75 41.53,30.75 41.52,30.74 40.64,30.74 40.01,31.37 40.01,32.43 39.45,33 38,33 37.25,33.75 37.25,35 36.25,36 29.34,36 27.5,34.16 U$9.4
MGND  (1 unrouted)
  Top 0.305: U$9.6 26.5,33.5 arc90 26.38,33.62
  Top 0.406: 26.45,33.7 26.38,33.62 26,33.25
  Top 1.016: 24.91,32.5 U$9.13 24.25,32.5
  Top 1.27: 24.83,33.25 24.16,33.25 C_HB-MOTOR.1 24.91,32.5 | 26,33.25 24.83,33.25 | 24.83,33.25 24.16,32.59 | 24.16,32.59 C_HB-BAT.2 23.66,31.58 23.66,30.23 | 24.25,32.5 arc-90 24.16,32.59
N$2
  Top 0.305: U$1.VCAP_2 64.01,39.49 63.58,39.92 C_VCAP2.2
N$3
  Top 1.27: U$2.+ 3.42,54.65 U$3.-
N$4
  Top 0.305: U$1.VCAP_1 74.4,35.87 V_VCAP1.2
N$5
  Top 0.305: C_G1.1 R_G1.1
N$6
  Top 1.27: U$3.+ 3.35,47.48 S1.3
N$7
  Top 0.254: R_IR-FR1.2 90.92,16.08 IR_FR.-
N$8
  Top 0.254: LED1.A 19.58,5.6 R_LED1.1
N$9
  Top 0.305: C_G2.2 85.3,31.25 GYRO.3 85.44,30.7 C_G1.2
N$10
  Top 0.254: LED2.A R_LED2.1
N$11
  Top 0.254: LED3.A 14.24,5.39 R_LED3.1
N$12
  Top 0.254: R_IR-FR1.1 87.29,16.44 T_IR-FR.3
N$15
  Top 0.254: IR_R.- 82.08,10.44 R_IR-R1.2
N$17
  Top 0.254: R_IR-FL1.2 90.11,46.02 IR_FL.-
N$22
  Top 0.254: T_IR-FL.3 86.92,44.53 R_IR-FL1.1
N$23
  Top 0.254: T_IR-R.3 80.8,11.6 R_IR-R1.1
N$24  (via drill 0.3)
  Top 0.305: v84,54 83.17,54 R_IR-L1.2
  Bottom 0.305: IR_L.- 84.58,54 v84,54
N$25
  Top 0.254: T_IR-L.3 81.06,53 82.47,53 R_IR-L1.1
NRST
  Top 0.254: R_NRST.1 3,11.95 NRST_SWITCH.3
  Top 0.305: PIN_HEADERS.2 59.71,56.24 59.71,38.29 61,37 63,37 66.51,33.49 U$1.NRST 66.51,19.51 59,12 26,12 23,9 23,3 21,1 8,1 5,4 5,9.95 3,11.95
REC_FL
  Top 0.254: R_IR-FL3.2 91.27,42.83 U$5.E
  Top 0.305: U$1.PB1 80.34,33.87 R_IR-FL3.2
REC_FR
  Top 0.254: R_IR-FR3.2 89,24.08 90.74,24.08 U$6.E
  Top 0.305: 89,24.08 87.58,25.5 82.5,25.5 79,29 79,30 77.25,31.75 74.25,31.75 73.87,31.37 U$1.PA6
REC_L  (via drill 0.3)
  Top 0.254: R_IR-L3.2 90.78,54.77 89.21,56.34 U$4.E
  Top 0.305: U$1.PB0 80.49,33.37 88.12,41 92,41 93,42 v93,45 | v93.05,48.05 93.05,52.5 90.78,54.77
  Bottom 0.305: v93,45 93,48 v93.05,48.05
REC_R  (via drill 0.3)
  Top 0.254: R_IR-R3.2 92.08,8.74 U$7.E
  Top 0.305: U$7.E 89.34,6 v87.16,6 | U$1.PC0 67.01,15.99 77,6 v85,6
  Bottom 0.305: v87.16,6 v85,6
RX
  Top 0.305: U$1.PA10 66.01,54.92 PIN_HEADERS.5
SWCLK
  Top 0.305: PIN_HEADERS.8 67.55,59 61,59 60.8,58.8 60.76,58.8 59.25,57.29 59.25,37.5 60.38,36.37 U$1.PA14
SWDIO
  Top 0.305: PIN_HEADERS.4 65,56.47 65,39.75 64.51,39.26 U$1.PA13
TX
  Top 0.305: U$1.PA9 66.51,52.88 PIN_HEADERS.7
VREF_G
  Top 0.305: U$1.PC4 80.63,32.37 82.3,30.7 GYRO.7